# Altium project S7CAS-PLEIADES-CARTES-MERE_P07.PrjPcb (part 4 of 4)

## Sheet S7CAS-PLEIADES-CARTE-MERE_P07_ADC.SchDoc
size Tabloid; DocumentNumber: 15; SheetNumber: 15; SheetTotal: 16; Sheet_Name: ADC; Size: 11x17
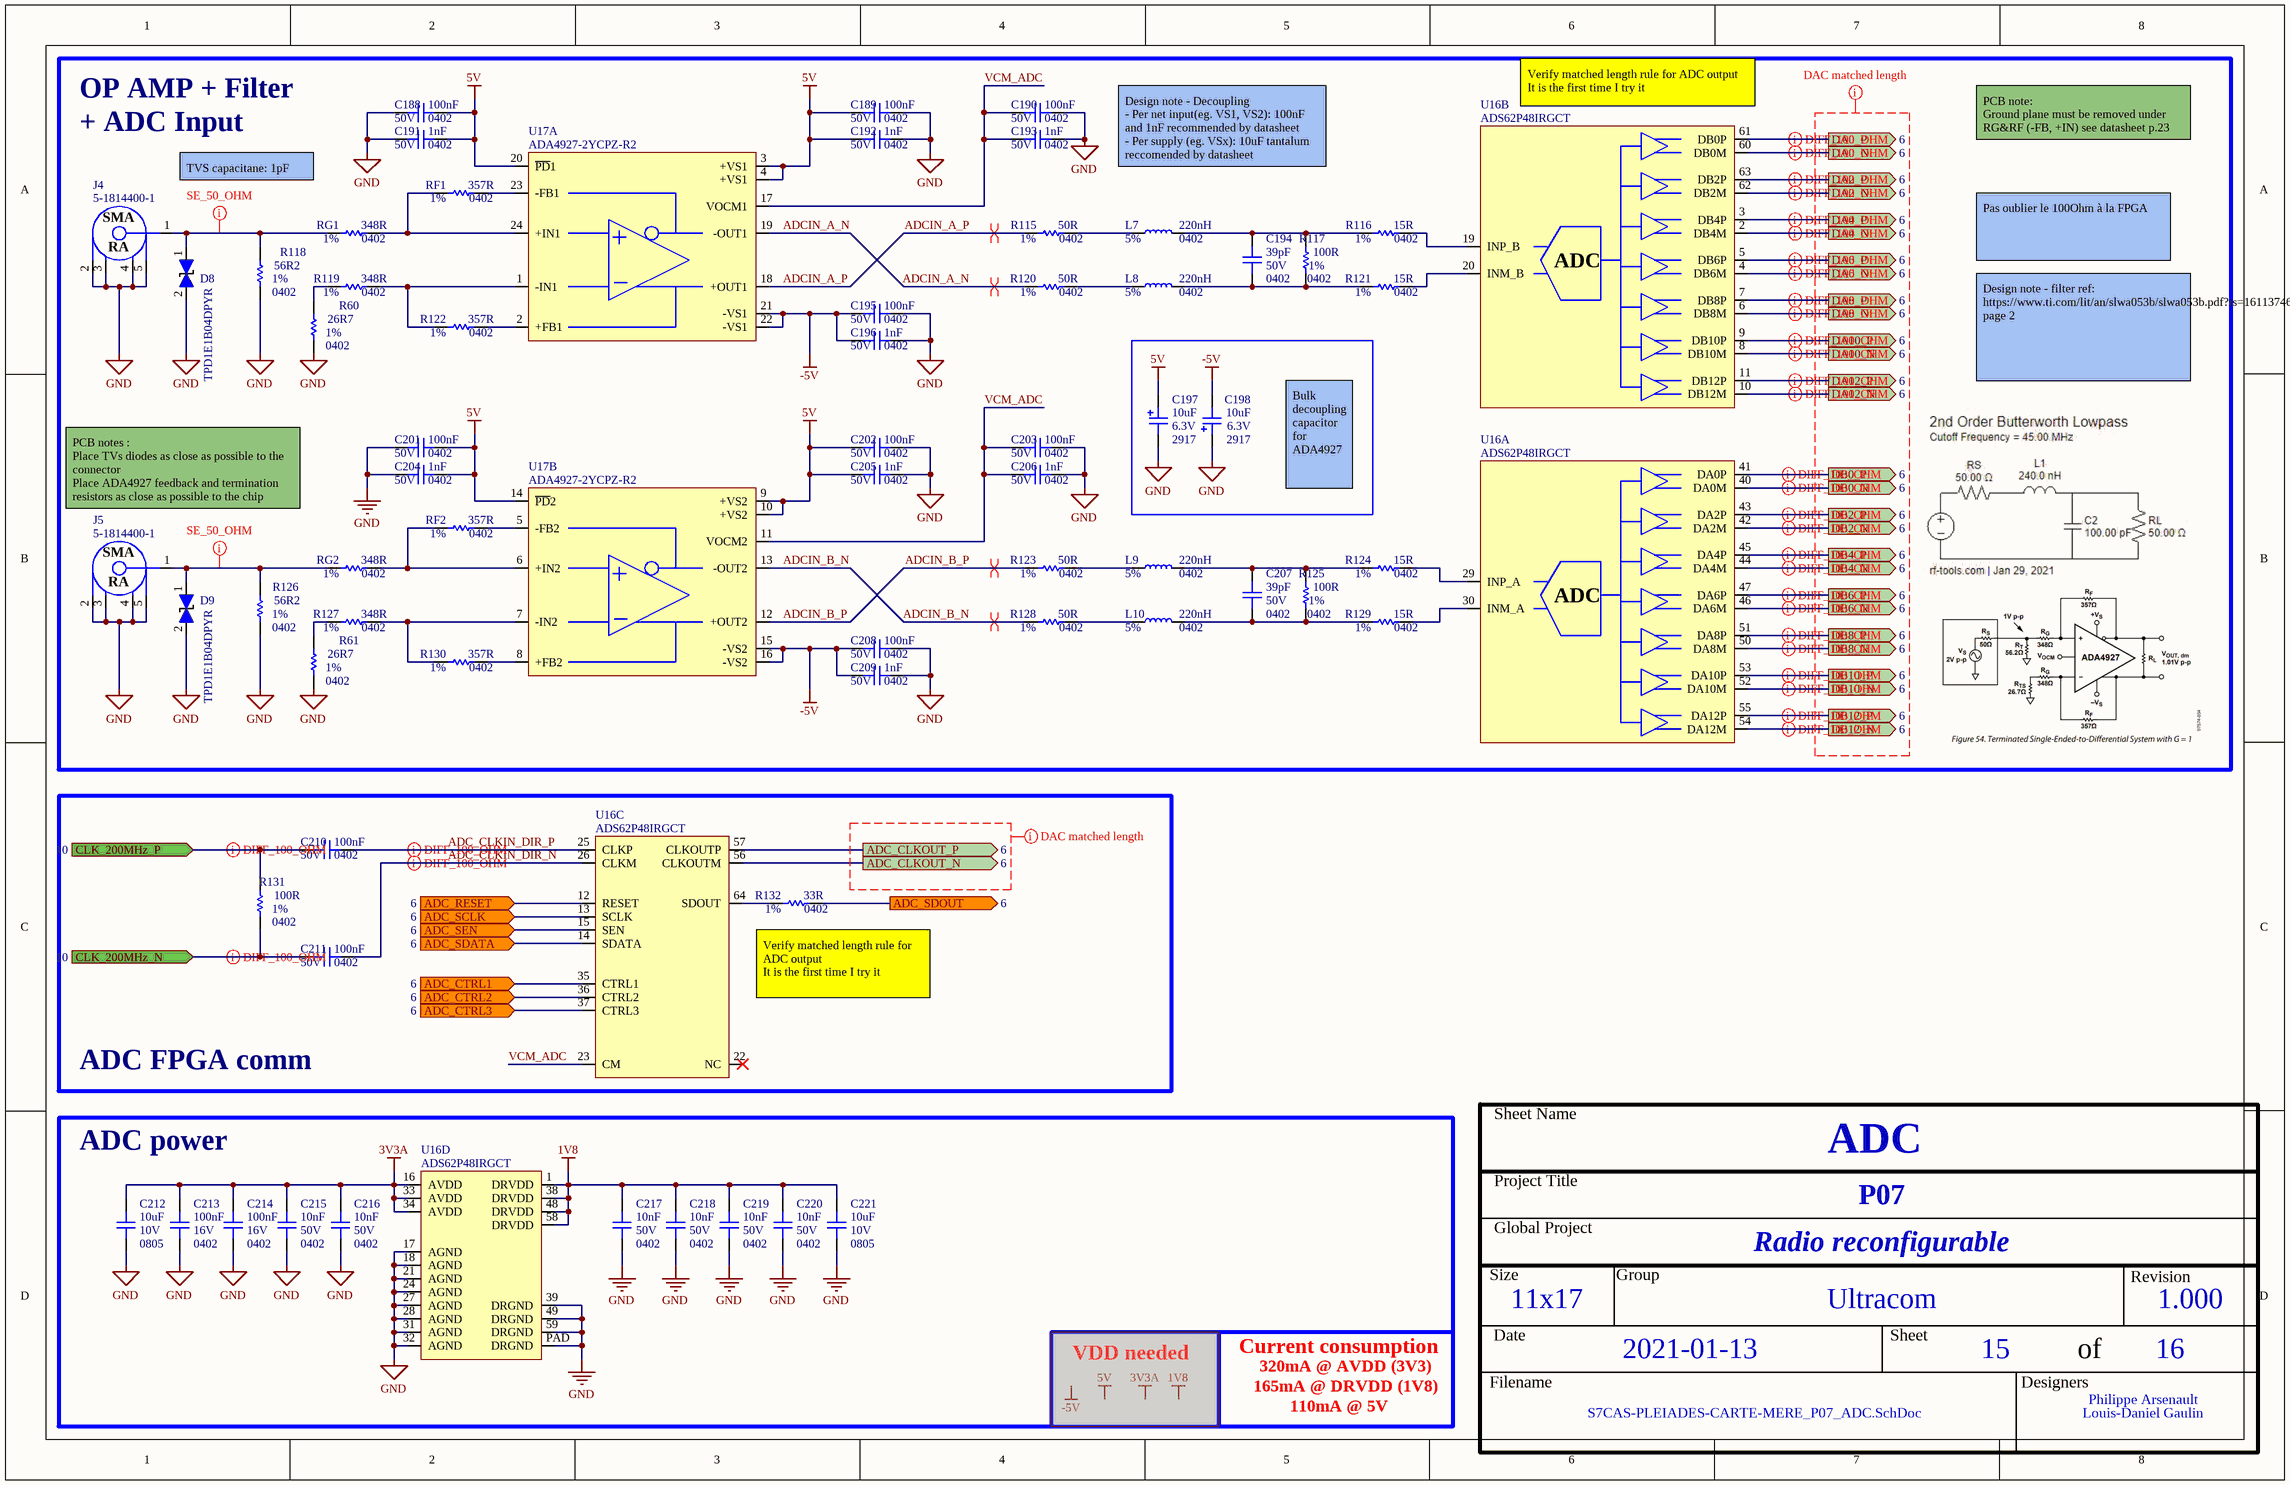
[diagram p14: S7CAS-PLEIADES-CARTE-MERE_P07_ADC.SchDoc]

### Parts
C188  value 100nF  Voltage: 50V  Package: 0402  [CAP_0402]  (hidden comment: CAP - 0402)
C189  value 100nF  Voltage: 50V  Package: 0402  [CAP_0402]  (hidden comment: CAP - 0402)
C190  value 100nF  Voltage: 50V  Package: 0402  [CAP_0402]  (hidden comment: CAP - 0402)
C191  value 1nF  Voltage: 50V  Package: 0402  [CAP_0402]  (hidden comment: CAP - 0402)
C192  value 1nF  Voltage: 50V  Package: 0402  [CAP_0402]  (hidden comment: CAP - 0402)
C193  value 1nF  Voltage: 50V  Package: 0402  [CAP_0402]  (hidden comment: CAP - 0402)
C194  value 39pF  Voltage: 50V  Package: 0402  [CAP_0402]  (hidden comment: CAP - 0402)
C195  value 100nF  Voltage: 50V  Package: 0402  [CAP_0402]  (hidden comment: CAP - 0402)
C196  value 1nF  Voltage: 50V  Package: 0402  [CAP_0402]  (hidden comment: CAP - 0402)
C197  value 10uF  Voltage: 6.3V  Package: 2917  [CAP_TAN_2917(D)]  (hidden comment: CAP - TANTALUM - CASE D)
C198  value 10uF  Voltage: 6.3V  Package: 2917  [CAP_TAN_2917(D)]  (hidden comment: CAP - TANTALUM - CASE D)
C201  value 100nF  Voltage: 50V  Package: 0402  [CAP_0402]  (hidden comment: CAP - 0402)
C202  value 100nF  Voltage: 50V  Package: 0402  [CAP_0402]  (hidden comment: CAP - 0402)
C203  value 100nF  Voltage: 50V  Package: 0402  [CAP_0402]  (hidden comment: CAP - 0402)
C204  value 1nF  Voltage: 50V  Package: 0402  [CAP_0402]  (hidden comment: CAP - 0402)
C205  value 1nF  Voltage: 50V  Package: 0402  [CAP_0402]  (hidden comment: CAP - 0402)
C206  value 1nF  Voltage: 50V  Package: 0402  [CAP_0402]  (hidden comment: CAP - 0402)
C207  value 39pF  Voltage: 50V  Package: 0402  [CAP_0402]  (hidden comment: CAP - 0402)
C208  value 100nF  Voltage: 50V  Package: 0402  [CAP_0402]  (hidden comment: CAP - 0402)
C209  value 1nF  Voltage: 50V  Package: 0402  [CAP_0402]  (hidden comment: CAP - 0402)
C210  value 100nF  Voltage: 50V  Package: 0402  [CAP_0402]  (hidden comment: CAP - 0402)
C211  value 100nF  Voltage: 50V  Package: 0402  [CAP_0402]  (hidden comment: CAP - 0402)
C212  value 10uF  Voltage: 10V  Package: 0805  [CAP_0805]  (hidden comment: CAP - 0805)
C213  value 100nF  Voltage: 16V  Package: 0402  [CAP_0402]  (hidden comment: CAP - 0402)
C214  value 100nF  Voltage: 16V  Package: 0402  [CAP_0402]  (hidden comment: CAP - 0402)
C215  value 10nF  Voltage: 50V  Package: 0402  [CAP_0402]  (hidden comment: CAP - 0402)
C216  value 10nF  Voltage: 50V  Package: 0402  [CAP_0402]  (hidden comment: CAP - 0402)
C217  value 10nF  Voltage: 50V  Package: 0402  [CAP_0402]  (hidden comment: CAP - 0402)
C218  value 10nF  Voltage: 50V  Package: 0402  [CAP_0402]  (hidden comment: CAP - 0402)
C219  value 10nF  Voltage: 50V  Package: 0402  [CAP_0402]  (hidden comment: CAP - 0402)
C220  value 10nF  Voltage: 50V  Package: 0402  [CAP_0402]  (hidden comment: CAP - 0402)
C221  value 10uF  Voltage: 10V  Package: 0805  [CAP_0805]  (hidden comment: CAP - 0805)
D8  TPD1E1B04DPYR  [TVS_DATA_TPD1E1B04DPYR]
D9  TPD1E1B04DPYR  [TVS_DATA_TPD1E1B04DPYR]
J4  5-1814400-1  [CONN_SMA_5-1814400-1]
J5  5-1814400-1  [CONN_SMA_5-1814400-1]
L7  value 220nH  Precision: 5%  Package: 0402  [IND_0402]  (hidden comment: IND_0402)
L8  value 220nH  Precision: 5%  Package: 0402  [IND_0402]  (hidden comment: IND_0402)
L9  value 220nH  Precision: 5%  Package: 0402  [IND_0402]  (hidden comment: IND_0402)
L10  value 220nH  Precision: 5%  Package: 0402  [IND_0402]  (hidden comment: IND_0402)
R60  value 26R7  Package: 0402  Precision: 1%  [RES_0402]  (hidden comment: RES - 0402)
R61  value 26R7  Package: 0402  Precision: 1%  [RES_0402]  (hidden comment: RES - 0402)
R115  value 50R  Package: 0402  Precision: 1%  [RES_0402]  (hidden comment: RES - 0402)
R116  value 15R  Package: 0402  Precision: 1%  [RES_0402]  (hidden comment: RES - 0402)
R117  value 100R  Package: 0402  Precision: 1%  [RES_0402]  (hidden comment: RES - 0402)
R118  value 56R2  Package: 0402  Precision: 1%  [RES_0402]  (hidden comment: RES - 0402)
R119  value 348R  Package: 0402  Precision: 1%  [RES_0402]  (hidden comment: RES - 0402)
R120  value 50R  Package: 0402  Precision: 1%  [RES_0402]  (hidden comment: RES - 0402)
R121  value 15R  Package: 0402  Precision: 1%  [RES_0402]  (hidden comment: RES - 0402)
R122  value 357R  Package: 0402  Precision: 1%  [RES_0402]  (hidden comment: RES - 0402)
R123  value 50R  Package: 0402  Precision: 1%  [RES_0402]  (hidden comment: RES - 0402)
R124  value 15R  Package: 0402  Precision: 1%  [RES_0402]  (hidden comment: RES - 0402)
R125  value 100R  Package: 0402  Precision: 1%  [RES_0402]  (hidden comment: RES - 0402)
R126  value 56R2  Package: 0402  Precision: 1%  [RES_0402]  (hidden comment: RES - 0402)
R127  value 348R  Package: 0402  Precision: 1%  [RES_0402]  (hidden comment: RES - 0402)
R128  value 50R  Package: 0402  Precision: 1%  [RES_0402]  (hidden comment: RES - 0402)
R129  value 15R  Package: 0402  Precision: 1%  [RES_0402]  (hidden comment: RES - 0402)
R130  value 357R  Package: 0402  Precision: 1%  [RES_0402]  (hidden comment: RES - 0402)
R131  value 100R  Package: 0402  Precision: 1%  [RES_0402]  (hidden comment: RES - 0402)
R132  value 33R  Package: 0402  Precision: 1%  [RES_0402]  (hidden comment: RES - 0402)
RF1  value 357R  Package: 0402  Precision: 1%  [RES_0402]  (hidden comment: RES - 0402)
RF2  value 357R  Package: 0402  Precision: 1%  [RES_0402]  (hidden comment: RES - 0402)
RG1  value 348R  Package: 0402  Precision: 1%  [RES_0402]  (hidden comment: RES - 0402)
RG2  value 348R  Package: 0402  Precision: 1%  [RES_0402]  (hidden comment: RES - 0402)
U16  ADS62P48IRGCT  [ADC_ADS62P48IRGCT]  (parts A,B,C,D of 4)
U17  ADA4927-2YCPZ-R2  [OPAMP_ADA4927-2YCPZ-R2]  (parts A,B of 2)

### Blocks framed on the sheet
ADC FPGA comm: C210 C211 R131 R132 U16
ADC power: C212-C221 U16

### Ports
ADC_CLKOUT_N (out, see 6), ADC_CLKOUT_P (out, see 6), ADC_CTRL1 (in, see 6), ADC_CTRL2 (in, see 6), ADC_CTRL3 (in, see 6), ADC_RESET (in, see 6), ADC_SCLK (in, see 6), ADC_SDATA (in, see 6), ADC_SDOUT (out, see 6), ADC_SEN (in, see 6), CLK_200MHz_N (in, see 10), CLK_200MHz_P (in, see 10), DA0_N (out, see 6), DA0_P (out, see 6), DA2_N (out, see 6), DA2_P (out, see 6), DA4_N (out, see 6), DA4_P (out, see 6), DA6_N (out, see 6), DA6_P (out, see 6), DA8_N (out, see 6), DA8_P (out, see 6), DA10_N (out, see 6), DA10_P (out, see 6), DA12_N (out, see 6), DA12_P (out, see 6), DB0_N (out, see 6), DB0_P (out, see 6), DB2_N (out, see 6), DB2_P (out, see 6), DB4_N (out, see 6), DB4_P (out, see 6), DB6_N (out, see 6), DB6_P (out, see 6), DB8_N (out, see 6), DB8_P (out, see 6), DB10_N (out, see 6), DB10_P (out, see 6), DB12_N (out, see 6), DB12_P (out, see 6)

### Nets
1V8: C217.2 C218.2 C219.2 C220.2 C221.2 U16.1(DRVDD) U16.38(DRVDD) U16.48(DRVDD) U16.58(DRVDD)
3V3A: C212.2 C213.2 C214.2 C215.2 C216.2 U16.16(AVDD) U16.33(AVDD) U16.34(AVDD)
5V: C188.1 C189.2 C191.1 C192.2 C197.1 C201.1 C202.2 C204.1 C205.2 U17.3(+VS1) U17.4(+VS1) U17.9(+VS2) U17.10(+VS2) U17.14(~{PD}2) U17.20(~{PD}1)
-5V: C195.2 C196.2 C198.2 C208.2 C209.2 U17.15(-VS2) U17.16(-VS2) U17.21(-VS1) U17.22(-VS1)
GND: C188.2 C189.1 C190.1 C191.2 C192.1 C193.1 C195.1 C196.1 C197.2 C198.1 C201.2 C202.1 C203.1 C204.2 C205.1 C206.1 C208.1 C209.1 C212.1 C213.1 C214.1 C215.1 C216.1 C217.1 C218.1 C219.1 C220.1 C221.1 D8.2(i/o) D9.2(i/o) J4.2 J4.3 J4.4 J4.5 J5.2 J5.3 J5.4 J5.5 R60.1 R61.1 R118.1 R126.1 U16.17(AGND) U16.18(AGND) U16.21(AGND) U16.24(AGND) U16.27(AGND) U16.28(AGND) U16.31(AGND) U16.32(AGND) U16.39(DRGND) U16.49(DRGND) U16.59(DRGND) U16.PAD(DRGND)
ADC_CLKIN_DIR_N: C211.1 U16.26(CLKM)
ADC_CLKIN_DIR_P: C210.1 U16.25(CLKP)
ADC_CLKOUT_N: U16.56(CLKOUTM) ; port ADC_CLKOUT_N
ADC_CLKOUT_P: U16.57(CLKOUTP) ; port ADC_CLKOUT_P
ADC_CTRL1: U16.35(CTRL1) ; port ADC_CTRL1
ADC_CTRL2: U16.36(CTRL2) ; port ADC_CTRL2
ADC_CTRL3: U16.37(CTRL3) ; port ADC_CTRL3
ADC_RESET: U16.12(RESET) ; port ADC_RESET
ADC_SCLK: U16.13(SCLK) ; port ADC_SCLK
ADC_SDATA: U16.14(SDATA) ; port ADC_SDATA
ADC_SDOUT: R132.1 ; port ADC_SDOUT
ADC_SEN: U16.15(SEN) ; port ADC_SEN
ADCIN_A_N: R120.2 U17.19(-OUT1)
ADCIN_A_P: R115.2 U17.18(+OUT1)
ADCIN_B_N: R128.2 U17.13(-OUT2)
ADCIN_B_P: R123.2 U17.12(+OUT2)
CLK_200MHz_N: C211.2 R131.1 ; port CLK_200MHz_N
CLK_200MHz_P: C210.2 R131.2 ; port CLK_200MHz_P
DA0_N: U16.60(DB0M) ; port DA0_N
DA0_P: U16.61(DB0P) ; port DA0_P
DA2_N: U16.62(DB2M) ; port DA2_N
DA2_P: U16.63(DB2P) ; port DA2_P
DA4_N: U16.2(DB4M) ; port DA4_N
DA4_P: U16.3(DB4P) ; port DA4_P
DA6_N: U16.4(DB6M) ; port DA6_N
DA6_P: U16.5(DB6P) ; port DA6_P
DA8_N: U16.6(DB8M) ; port DA8_N
DA8_P: U16.7(DB8P) ; port DA8_P
DA10_N: U16.8(DB10M) ; port DA10_N
DA10_P: U16.9(DB10P) ; port DA10_P
DA12_N: U16.10(DB12M) ; port DA12_N
DA12_P: U16.11(DB12P) ; port DA12_P
DB0_N: U16.40(DA0M) ; port DB0_N
DB0_P: U16.41(DA0P) ; port DB0_P
DB2_N: U16.42(DA2M) ; port DB2_N
DB2_P: U16.43(DA2P) ; port DB2_P
DB4_N: U16.44(DA4M) ; port DB4_N
DB4_P: U16.45(DA4P) ; port DB4_P
DB6_N: U16.46(DA6M) ; port DB6_N
DB6_P: U16.47(DA6P) ; port DB6_P
DB8_N: U16.50(DA8M) ; port DB8_N
DB8_P: U16.51(DA8P) ; port DB8_P
DB10_N: U16.52(DA10M) ; port DB10_N
DB10_P: U16.53(DA10P) ; port DB10_P
DB12_N: U16.54(DA12M) ; port DB12_N
DB12_P: U16.55(DA12P) ; port DB12_P
VCM_ADC: C190.2 C193.2 C203.2 C206.2 U16.23(CM) U17.11(VOCM2) U17.17(VOCM1)
NetC194_1: C194.1 L8.1 R117.1 R121.2
NetC194_2: C194.2 L7.1 R116.2 R117.2
NetC207_1: C207.1 L10.1 R125.1 R129.2
NetC207_2: C207.2 L9.1 R124.2 R125.2
NetD8_1: D8.1(i/o) J4.1 R118.2 RG1.2
NetD9_1: D9.1(i/o) J5.1 R126.2 RG2.2
NetL7_2: L7.2 R115.1
NetL8_2: L8.2 R120.1
NetL9_2: L9.2 R123.1
NetL10_2: L10.2 R128.1
NetR60_2: R60.2 R119.2
NetR61_2: R61.2 R127.2
NetR116_1: R116.1 U16.19(INP_B)
NetR119_1: R119.1 R122.2 U17.1(-IN1)
NetR121_1: R121.1 U16.20(INM_B)
NetR122_1: R122.1 U17.2(+FB1)
NetR124_1: R124.1 U16.29(INP_A)
NetR127_1: R127.1 R130.2 U17.7(-IN2)
NetR129_1: R129.1 U16.30(INM_A)
NetR130_1: R130.1 U17.8(+FB2)
NetR132_2: R132.2 U16.64(SDOUT)
NetRF1_1: RF1.1 U17.23(-FB1)
NetRF1_2: RF1.2 RG1.1 U17.24(+IN1)
NetRF2_1: RF2.1 U17.5(-FB2)
NetRF2_2: RF2.2 RG2.1 U17.6(+IN2)

Not connected (* = marked no-connect by the designer): U16 22(NC)*

### Layout directives
differential pair; net class DIFF_100_OHM: ADC_CLKIN_DIR_N, ADC_CLKIN_DIR_P, CLK_200MHz_N, CLK_200MHz_P
differential pair; differential pair class DIFF_100_OHM: DA0_N, DA0_P, DA2_N, DA2_P, DA4_N, DA4_P, DA6_N, DA6_P, DA8_N, DA8_P, DA10_N, DA10_P, DA12_N, DA12_P, DB0_N, DB0_P, DB2_N, DB2_P, DB4_N, DB4_P, DB6_N, DB6_P, DB8_N, DB8_P, DB10_N, DB10_P, DB12_N, DB12_P
rule Matched Net Lengths [Tolerance = 1mil]; net class DAC_OUT: (no net found under the mark)
mark named SE_50_OHM: NetD8_1, NetD9_1
differential pair: ADCIN_A_N, ADCIN_A_P, ADCIN_B_N, ADCIN_B_P

### Notes on the sheet
- OP AMP + Filter
- + ADC Input
- Design note - Decoupling
  - Per net input(eg. VS1, VS2): 100nF and 1nF recommended by datasheet
  - Per supply (eg. VSx): 10uF tantalum reccomended by datasheet
- (near U16) Verify matched length rule for ADC output
  It is the first time I try it
- PCB note:
  Ground plane must be removed under RG&RF (-FB, +IN) see datasheet p.23
- TVS capacitane: 1pF nom.
- Pas oublier le 100Ohm à la FPGA
- Design note - filter ref:
  https://www.ti.com/lit/an/slwa053b/slwa053b.pdf?ts=1611374664037&ref_url=https%253A%252F%252Fwww.google.com%252F
  page 2
- Bulk decoupling capacitor for ADA4927
- PCB notes :
  Place TVs diodes as close as possible to the connector
  Place ADA4927 feedback and termination resistors as close as possible to the chip
- Verify matched length rule for ADC output
  It is the first time I try it
- VDD needed
- Current consumption
- 320mA @ AVDD (3V3)
- 110mA @ 5V
- 165mA @ DRVDD (1V8)
- Sheet Name
- Project Title
- Global Project
- Size
- Group
- Revision
- Date
- Sheet
- of
- Filename
- Designers
- (in symbol ADC_ADS62P48IRGCT, part A) ADC
- (in symbol ADC_ADS62P48IRGCT, part B) ADC
- (in symbol CONN_SMA_5-1814400-1) SMA; RA

### Library data of the parts
C188-C196 C201-C211 = CAP - 0402: Precision: 10%; Current: *; CreatedBy: Jonathan Bouchard; Power: *
C197 C198 = CAP_TANT_2917(D): CAP - TANTALUM - 2917; Precision: 10%; Current: *; CreatedBy: Jonathan Bouchard; Power: *
C212 C221 = CAP - 0805: Mfg: CL21B106KPQNNNE; Precision: 10%; Current: *; CreatedBy: Jonathan Bouchard; Power: *
C213 C214 = CAP - 0402: Mfg Part Number: CL05B104KO5NNNC; Precision: 10%; Current: *; CreatedBy: Jonathan Bouchard; Power: *
C215-C220 = CAP - 0402: Mfg Part Number: CL05B103KB5NNNC; Precision: 10%; Current: *; CreatedBy: Jonathan Bouchard; Temperature: X7R; Power: *
D8 D9 = TVS_DATA_TPD1E1B04DPYR: TVS - TVS DIODE 3.6V 8.5V - 0402; Manufacturer #1: Texas Instruments; Current Rating: 6.3Apeak; Power Max: 50Wpeak; GRAMS Lib Spec: 2.8; Magnetic Material: Unknown; Polarized: No; Value: *; Tolerance: *; Voltage Rating: 3.6V; HelpURL: http://www.ti.com/lit/ds/symlink/tpd1e1b04.pdf; CreatedBy/Date: Keven Deslandes - 2018/10/19; VerifiedBy: Caroline Paulin - 28 janv 2019; Temperature: -40°C ~ 125°C (TA); Package: 0402; Manufacturer #2: *; Note: *; Assembly Type: SMD; Part Number #2: *; Part Number #1: TPD1E1B04DPYR; Supplier 1: Digi-Key; Supplier Part Number 1: 296-47364-1-ND; Cryo: UNKNOWN
J4 J5 = CONN_SMA_5-1814400-1: CONN -  SMA JACK R/A 50 OHM - TH; Mfg: TE Connectivity AMP Connectors; Voltage: *; Current: *; Power: *; Mfg Part Number: 5-1814400-1; HelpURL: http://www.te.com/commerce/DocumentDelivery/DDEController?Action=srchrtrv&DocNm=1814400&DocType=Customer+Drawing&DocLang=English; CreatedBy: Jonathan Bouchard; Temperature: -55°C ~ 85°C; Value: *; Precision: *; Package: TH-5; Supplier 1: Digikey; Supplier Part Number 1: A97593-ND
R60 R61 R115-R132 RF1 RF2 RG1 RG2 = RES - 0402: Voltage: 50V; Power: 1/16W; Current: *; CreatedBy: Jonathan Bouchard
U16 = ADC_ADS62P48IRGCT: ADC - 14 BIT 210MSPS SUAL - VQFN-64; Voltage: 3.15 V ~ 3.6 V / 1.7 V ~ 1.9 V; Mfg: Texas Instruments; Precision: 14 Bit; Current: *; Power: *; Mfg Part Number: ADS62P48IRGCT; HelpURL: http://www.ti.com/lit/ds/symlink/ads62p48.pdf; CreatedBy: Jonathan Bouchard; Temperature: -40°C ~ 85°C; Value: *; Package: VQFN-64; Supplier 1: Digikey; Supplier Part Number 1: 296-24611-1-ND
U17 = OPAMP_ADA4927-2YCPZ-R2: OPAMP - CFA 2.3GHZ - QFN-24; Voltage: 4.5 V ~ 11 V, ±2.25 V ~ 5.5 V; Current: 65mA; Mfg: Analog Devices; Power: *; Mfg Part Number: ADA4927-2YCPZ-R2; HelpURL: http://www.analog.com/media/en/technical-documentation/data-sheets/ADA4927-1_4927-2.pdf; CreatedBy: Jonathan Bouchard; Temperature: -40°C ~ 105°C; Value: *; Precision: *; Package: QFN-24; Supplier 1: Digikey; Supplier Part Number 1: ADA4927-2YCPZ-R2CT-ND
L7-L10 = IND_0402: Voltage: *; CreatedBy: Jonathan Bouchard; Power: *; NI: *; Current: *

## Sheet S7CAS-PLEIADES-CARTE-MERE_P07_DAC.SchDoc
size Tabloid; DocumentNumber: 16; SheetNumber: 16; SheetTotal: 16; Sheet_Name: DAC; Size: 11x17
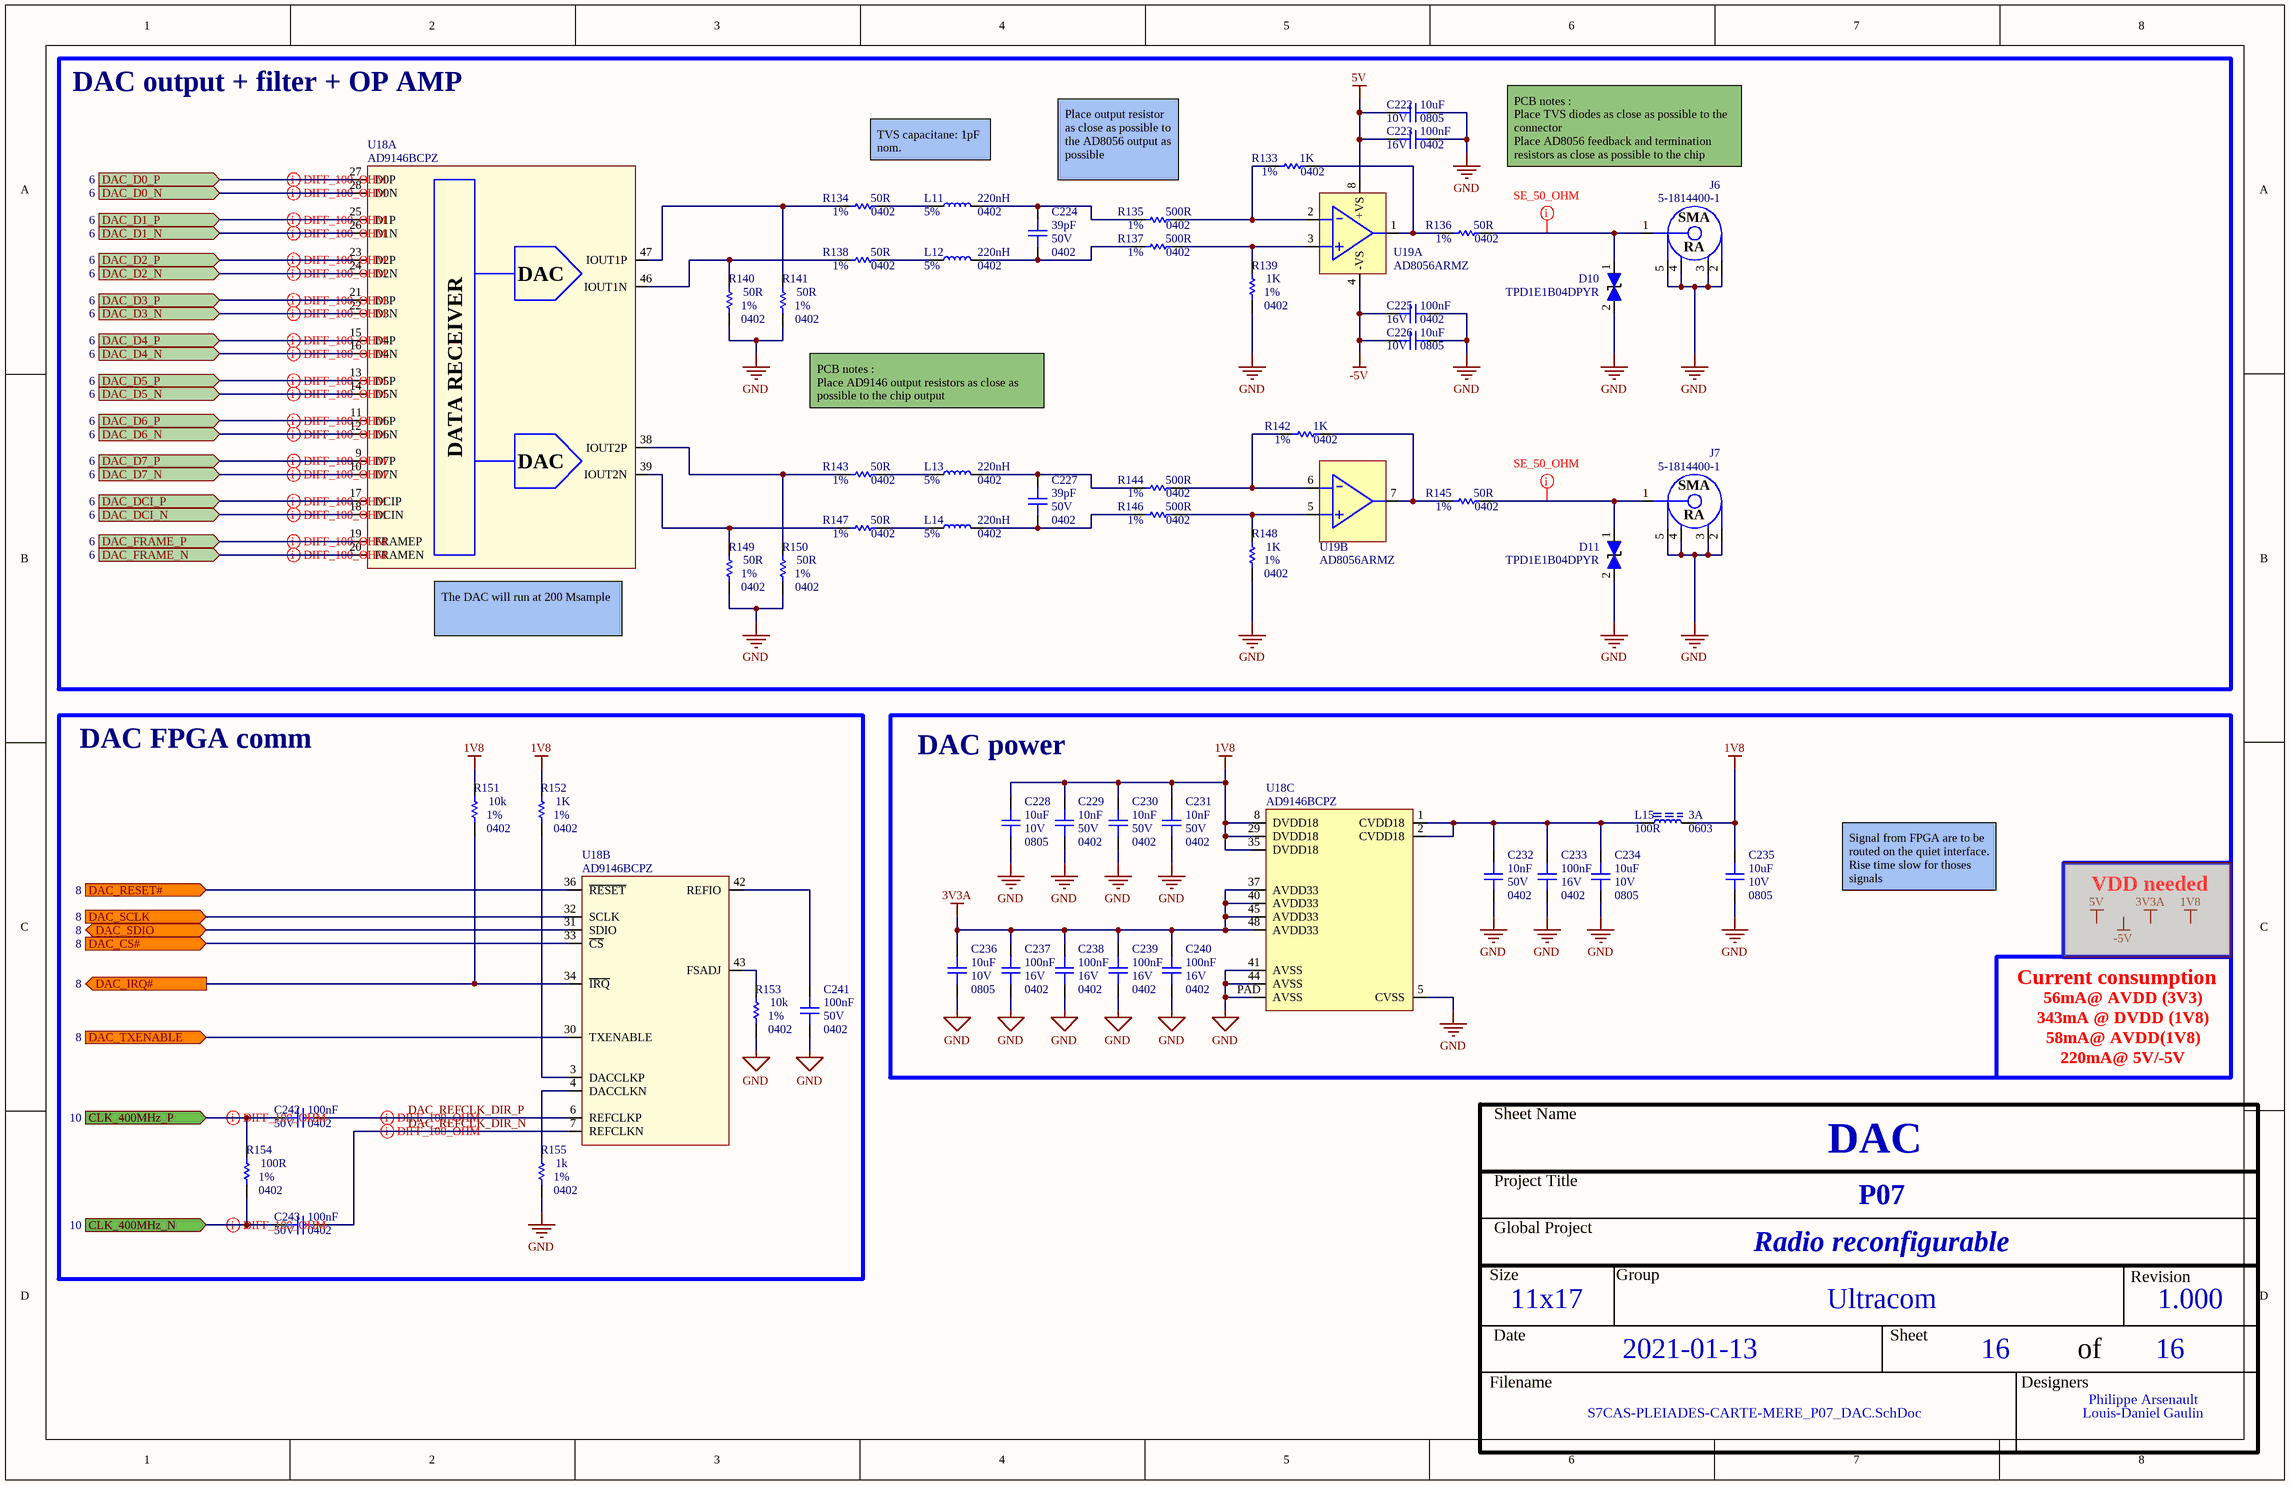
[diagram p15: S7CAS-PLEIADES-CARTE-MERE_P07_DAC.SchDoc]

### Parts
C222  value 10uF  Voltage: 10V  Package: 0805  [CAP_0805]  (hidden comment: CAP - 0805)
C223  value 100nF  Voltage: 16V  Package: 0402  [CAP_0402]  (hidden comment: CAP - 0402)
C224  value 39pF  Voltage: 50V  Package: 0402  [CAP_0402]  (hidden comment: CAP - 0402)
C225  value 100nF  Voltage: 16V  Package: 0402  [CAP_0402]  (hidden comment: CAP - 0402)
C226  value 10uF  Voltage: 10V  Package: 0805  [CAP_0805]  (hidden comment: CAP - 0805)
C227  value 39pF  Voltage: 50V  Package: 0402  [CAP_0402]  (hidden comment: CAP - 0402)
C228  value 10uF  Voltage: 10V  Package: 0805  [CAP_0805]  (hidden comment: CAP - 0805)
C229  value 10nF  Voltage: 50V  Package: 0402  [CAP_0402]  (hidden comment: CAP - 0402)
C230  value 10nF  Voltage: 50V  Package: 0402  [CAP_0402]  (hidden comment: CAP - 0402)
C231  value 10nF  Voltage: 50V  Package: 0402  [CAP_0402]  (hidden comment: CAP - 0402)
C232  value 10nF  Voltage: 50V  Package: 0402  [CAP_0402]  (hidden comment: CAP - 0402)
C233  value 100nF  Voltage: 16V  Package: 0402  [CAP_0402]  (hidden comment: CAP - 0402)
C234  value 10uF  Voltage: 10V  Package: 0805  [CAP_0805]  (hidden comment: CAP - 0805)
C235  value 10uF  Voltage: 10V  Package: 0805  [CAP_0805]  (hidden comment: CAP - 0805)
C236  value 10uF  Voltage: 10V  Package: 0805  [CAP_0805]  (hidden comment: CAP - 0805)
C237  value 100nF  Voltage: 16V  Package: 0402  [CAP_0402]  (hidden comment: CAP - 0402)
C238  value 100nF  Voltage: 16V  Package: 0402  [CAP_0402]  (hidden comment: CAP - 0402)
C239  value 100nF  Voltage: 16V  Package: 0402  [CAP_0402]  (hidden comment: CAP - 0402)
C240  value 100nF  Voltage: 16V  Package: 0402  [CAP_0402]  (hidden comment: CAP - 0402)
C241  value 100nF  Voltage: 50V  Package: 0402  [CAP_0402]  (hidden comment: CAP - 0402)
C242  value 100nF  Voltage: 50V  Package: 0402  [CAP_0402]  (hidden comment: CAP - 0402)
C243  value 100nF  Voltage: 50V  Package: 0402  [CAP_0402]  (hidden comment: CAP - 0402)
D10  TPD1E1B04DPYR  [TVS_DATA_TPD1E1B04DPYR]
D11  TPD1E1B04DPYR  [TVS_DATA_TPD1E1B04DPYR]
J6  5-1814400-1  [CONN_SMA_5-1814400-1]
J7  5-1814400-1  [CONN_SMA_5-1814400-1]
L11  value 220nH  Precision: 5%  Package: 0402  [IND_0402]  (hidden comment: IND_0402)
L12  value 220nH  Precision: 5%  Package: 0402  [IND_0402]  (hidden comment: IND_0402)
L13  value 220nH  Precision: 5%  Package: 0402  [IND_0402]  (hidden comment: IND_0402)
L14  value 220nH  Precision: 5%  Package: 0402  [IND_0402]  (hidden comment: IND_0402)
L15  value 100R  Current: 3A  Package: 0603  [FER_0603]  (hidden comment: FER - 0603)
R133  value 1K  Package: 0402  Precision: 1%  [RES_0402]  (hidden comment: RES - 0402)
R134  value 50R  Package: 0402  Precision: 1%  [RES_0402]  (hidden comment: RES - 0402)
R135  value 500R  Package: 0402  Precision: 1%  [RES_0402]  (hidden comment: RES - 0402)
R136  value 50R  Package: 0402  Precision: 1%  [RES_0402]  (hidden comment: RES - 0402)
R137  value 500R  Package: 0402  Precision: 1%  [RES_0402]  (hidden comment: RES - 0402)
R138  value 50R  Package: 0402  Precision: 1%  [RES_0402]  (hidden comment: RES - 0402)
R139  value 1K  Package: 0402  Precision: 1%  [RES_0402]  (hidden comment: RES - 0402)
R140  value 50R  Package: 0402  Precision: 1%  [RES_0402]  (hidden comment: RES - 0402)
R141  value 50R  Package: 0402  Precision: 1%  [RES_0402]  (hidden comment: RES - 0402)
R142  value 1K  Package: 0402  Precision: 1%  [RES_0402]  (hidden comment: RES - 0402)
R143  value 50R  Package: 0402  Precision: 1%  [RES_0402]  (hidden comment: RES - 0402)
R144  value 500R  Package: 0402  Precision: 1%  [RES_0402]  (hidden comment: RES - 0402)
R145  value 50R  Package: 0402  Precision: 1%  [RES_0402]  (hidden comment: RES - 0402)
R146  value 500R  Package: 0402  Precision: 1%  [RES_0402]  (hidden comment: RES - 0402)
R147  value 50R  Package: 0402  Precision: 1%  [RES_0402]  (hidden comment: RES - 0402)
R148  value 1K  Package: 0402  Precision: 1%  [RES_0402]  (hidden comment: RES - 0402)
R149  value 50R  Package: 0402  Precision: 1%  [RES_0402]  (hidden comment: RES - 0402)
R150  value 50R  Package: 0402  Precision: 1%  [RES_0402]  (hidden comment: RES - 0402)
R151  value 10k  Package: 0402  Precision: 1%  [RES_0402]  (hidden comment: RES - 0402)
R152  value 1K  Package: 0402  Precision: 1%  [RES_0402]  (hidden comment: RES - 0402)
R153  value 10k  Package: 0402  Precision: 1%  [RES_0402]  (hidden comment: RES - 0402)
R154  value 100R  Package: 0402  Precision: 1%  [RES_0402]  (hidden comment: RES - 0402)
R155  value 1k  Package: 0402  Precision: 1%  [RES_0402]  (hidden comment: RES - 0402)
U18  AD9146BCPZ  [DAC_AD9146BCPZ]  (parts A,B,C of 3)
U19  AD8056ARMZ  [OPAMP_AD8056ARMZ]  (parts A,B of 2)

### Blocks framed on the sheet
DAC output + filter + OP AMP: C222-C227 D10 D11 J6 J7 L11-L14 R133-R150 U18 U19
DAC FPGA comm: C241-C243 R151-R155 U18
DAC power: C228-C240 L15 U18

### Ports
CLK_400MHz_N (in, see 10), CLK_400MHz_P (in, see 10), DAC_CS# (in, see 8), DAC_D0_N (in, see 6), DAC_D0_P (in, see 6), DAC_D1_N (in, see 6), DAC_D1_P (in, see 6), DAC_D2_N (in, see 6), DAC_D2_P (in, see 6), DAC_D3_N (in, see 6), DAC_D3_P (in, see 6), DAC_D4_N (in, see 6), DAC_D4_P (in, see 6), DAC_D5_N (in, see 6), DAC_D5_P (in, see 6), DAC_D6_N (in, see 6), DAC_D6_P (in, see 6), DAC_D7_N (in, see 6), DAC_D7_P (in, see 6), DAC_DCI_N (in, see 6), DAC_DCI_P (in, see 6), DAC_FRAME_N (in, see 6), DAC_FRAME_P (in, see 6), DAC_IRQ# (out, see 8), DAC_RESET# (in, see 8), DAC_SCLK (in, see 8), DAC_SDIO (bidir, see 8), DAC_TXENABLE (in, see 8)

### Nets
1V8: C228.2 C229.2 C230.2 C231.2 C235.2 L15.1 R151.2 R152.2 U18.8(DVDD18) U18.29(DVDD18) U18.35(DVDD18)
3V3A: C236.2 C237.2 C238.2 C239.2 C240.2 U18.37(AVDD33) U18.40(AVDD33) U18.45(AVDD33) U18.48(AVDD33)
5V: C222.2 C223.2 U19.8(+VS)
-5V: C225.2 C226.2 U19.4(-VS)
GND: C222.1 C223.1 C225.1 C226.1 C228.1 C229.1 C230.1 C231.1 C232.1 C233.1 C234.1 C235.1 C236.1 C237.1 C238.1 C239.1 C240.1 C241.1 D10.2(i/o) D11.2(i/o) J6.2 J6.3 J6.4 J6.5 J7.2 J7.3 J7.4 J7.5 R139.1 R140.1 R141.1 R148.1 R149.1 R150.1 R153.1 R155.1 U18.5(CVSS) U18.41(AVSS) U18.44(AVSS) U18.PAD(AVSS)
CLK_400MHz_N: C243.2 R154.1 ; port CLK_400MHz_N
CLK_400MHz_P: C242.2 R154.2 ; port CLK_400MHz_P
DAC_CS#: U18.33(~{CS}) ; port DAC_CS#
DAC_D0_N: U18.28(D0N) ; port DAC_D0_N
DAC_D0_P: U18.27(D0P) ; port DAC_D0_P
DAC_D1_N: U18.26(D1N) ; port DAC_D1_N
DAC_D1_P: U18.25(D1P) ; port DAC_D1_P
DAC_D2_N: U18.24(D2N) ; port DAC_D2_N
DAC_D2_P: U18.23(D2P) ; port DAC_D2_P
DAC_D3_N: U18.22(D3N) ; port DAC_D3_N
DAC_D3_P: U18.21(D3P) ; port DAC_D3_P
DAC_D4_N: U18.16(D4N) ; port DAC_D4_N
DAC_D4_P: U18.15(D4P) ; port DAC_D4_P
DAC_D5_N: U18.14(D5N) ; port DAC_D5_N
DAC_D5_P: U18.13(D5P) ; port DAC_D5_P
DAC_D6_N: U18.12(D6N) ; port DAC_D6_N
DAC_D6_P: U18.11(D6P) ; port DAC_D6_P
DAC_D7_N: U18.10(D7N) ; port DAC_D7_N
DAC_D7_P: U18.9(D7P) ; port DAC_D7_P
DAC_DCI_N: U18.18(DCIN) ; port DAC_DCI_N
DAC_DCI_P: U18.17(DCIP) ; port DAC_DCI_P
DAC_FRAME_N: U18.20(FRAMEN) ; port DAC_FRAME_N
DAC_FRAME_P: U18.19(FRAMEP) ; port DAC_FRAME_P
DAC_IRQ#: R151.1 U18.34(~{IRQ}) ; port DAC_IRQ#
DAC_REFCLK_DIR_N: C243.1 U18.7(REFCLKN)
DAC_REFCLK_DIR_P: C242.1 U18.6(REFCLKP)
DAC_RESET#: U18.36(~{RESET}) ; port DAC_RESET#
DAC_SCLK: U18.32(SCLK) ; port DAC_SCLK
DAC_SDIO: U18.31(SDIO) ; port DAC_SDIO
DAC_TXENABLE: U18.30(TXENABLE) ; port DAC_TXENABLE
NetC224_1: C224.1 L12.1 R137.2
NetC224_2: C224.2 L11.1 R135.2
NetC227_1: C227.1 L14.1 R146.2
NetC227_2: C227.2 L13.1 R144.2
NetC232_2: C232.2 C233.2 C234.2 L15.2 U18.1(CVDD18) U18.2(CVDD18)
NetC241_2: C241.2 U18.42(REFIO)
NetD10_1: D10.1(i/o) J6.1 R136.1
NetD11_1: D11.1(i/o) J7.1 R145.1
NetL11_2: L11.2 R134.1
NetL12_2: L12.2 R138.1
NetL13_2: L13.2 R143.1
NetL14_2: L14.2 R147.1
NetR133_1: R133.1 R136.2 U19.1(OUT1)
NetR133_2: R133.2 R135.1 U19.2(-IN1)
NetR134_2: R134.2 R141.2 U18.47(IOUT1P)
NetR137_1: R137.1 R139.2 U19.3(+IN1)
NetR138_2: R138.2 R140.2 U18.46(IOUT1N)
NetR142_1: R142.1 R145.2 U19.7(OUT2)
NetR142_2: R142.2 R144.1 U19.6(-IN2)
NetR143_2: R143.2 R150.2 U18.38(IOUT2P)
NetR146_1: R146.1 R148.2 U19.5(+IN2)
NetR147_2: R147.2 R149.2 U18.39(IOUT2N)
NetR152_1: R152.1 U18.3(DACCLKP)
NetR153_2: R153.2 U18.43(FSADJ)
NetR155_2: R155.2 U18.4(DACCLKN)

### Layout directives
differential pair; differential pair class DIFF_100_OHM: DAC_D0_N, DAC_D0_P, DAC_D1_N, DAC_D1_P, DAC_D2_N, DAC_D2_P, DAC_D3_N, DAC_D3_P, DAC_D4_N, DAC_D4_P, DAC_D5_N, DAC_D5_P, DAC_D6_N, DAC_D6_P, DAC_D7_N, DAC_D7_P, DAC_DCI_N, DAC_DCI_P, DAC_FRAME_N, DAC_FRAME_P
mark named SE_50_OHM: NetD10_1, NetD11_1
differential pair; net class DIFF_100_OHM: CLK_400MHz_N, CLK_400MHz_P, DAC_REFCLK_DIR_N, DAC_REFCLK_DIR_P

### Notes on the sheet
- TVS capacitane: 1pF nom.
- PCB notes :
  Place TVS diodes as close as possible to the connector
  Place AD8056 feedback and termination resistors as close as possible to the chip
- Place output resistor as close as possible to the AD8056 output as possible
- PCB notes :
  Place AD9146 output resistors as close as possible to the chip output
- (near U18) The DAC will run at 200 Msample
- Signal from FPGA are to be routed on the quiet interface. Rise time slow for thoses signals
- VDD needed
- Current consumption
- 56mA@ AVDD (3V3)
- 343mA @ DVDD (1V8)
- 58mA@ AVDD(1V8)
- 220mA@ 5V/-5V
- Sheet Name
- Project Title
- Global Project
- Size
- Group
- Revision
- Date
- Sheet
- of
- Filename
- Designers
- (in symbol CONN_SMA_5-1814400-1) SMA; RA
- (in symbol DAC_AD9146BCPZ, part A) DAC; DATA RECEIVER

### Library data of the parts
C222 C226 C228 C234-C236 = CAP - 0805: Mfg: CL21B106KPQNNNE; Precision: 10%; Current: *; CreatedBy: Jonathan Bouchard; Power: *
C223 C225 C233 C237-C240 = CAP - 0402: as C213 on sheet S7CAS-PLEIADES-CARTE-MERE_P07_ADC; Current: *; CreatedBy: Jonathan Bouchard; Power: *
C224 C227 C241-C243 = CAP - 0402: Precision: 10%; Current: *; CreatedBy: Jonathan Bouchard; Power: *
C229-C232 = CAP - 0402: as C215 on sheet S7CAS-PLEIADES-CARTE-MERE_P07_ADC; Current: *; CreatedBy: Jonathan Bouchard; Temperature: X7R; Power: *
D10 D11 = TVS_DATA_TPD1E1B04DPYR: as D8 on sheet S7CAS-PLEIADES-CARTE-MERE_P07_ADC; Value: *; Tolerance: *; Voltage Rating: 3.6V; HelpURL: http://www.ti.com/lit/ds/symlink/tpd1e1b04.pdf; CreatedBy/Date: Keven Deslandes - 2018/10/19; VerifiedBy: Caroline Paulin - 28 janv 2019; Temperature: -40°C ~ 125°C (TA); Package: 0402; Manufacturer #2: *; Note: *; Assembly Type: SMD; Part Number #2: *; Part Number #1: TPD1E1B04DPYR; Supplier 1: Digi-Key; Supplier Part Number 1: 296-47364-1-ND; Cryo: UNKNOWN
J6 J7 = CONN_SMA_5-1814400-1: as J4 on sheet S7CAS-PLEIADES-CARTE-MERE_P07_ADC; Voltage: *; Current: *; Power: *; Mfg Part Number: 5-1814400-1; HelpURL: http://www.te.com/commerce/DocumentDelivery/DDEController?Action=srchrtrv&DocNm=1814400&DocType=Customer+Drawing&DocLang=English; CreatedBy: Jonathan Bouchard; Temperature: -55°C ~ 85°C; Value: *; Precision: *; Package: TH-5; Supplier 1: Digikey; Supplier Part Number 1: A97593-ND
R133-R155 = RES - 0402: Voltage: 50V; Power: 1/16W; Current: *; CreatedBy: Jonathan Bouchard
U18 = DAC_AD9146BCPZ: DAC - 16BIT SRL HIGH SPEED - QFN-48; Voltage: 3.13 V ~ 3.47 V / 1.71 V ~ 1.89 V; Mfg: Analog Devices Inc.; Current: *; Power: *; Mfg Part Number: AD9146BCPZ; HelpURL: http://www.analog.com/media/en/technical-documentation/data-sheets/AD9146.PDF; CreatedBy: Jonathan Bouchard; Temperature: -40°C ~ 85°C; Value: *; Precision: 16 Bit; Package: QFN-48; Supplier 1: Digikey; Supplier Part Number 1: AD9146BCPZ-ND
U19 = OPAMP_AD8056ARMZ: OPAMP - VFB 300MHZ - 8MSOP; Voltage: 8 V ~ 12 V, ±4 V ~ 6 V; Current: 60mA; Mfg: Analog Devices; Power: *; Mfg Part Number: AD8056ARMZ; HelpURL: http://www.analog.com/media/en/technical-documentation/data-sheets/AD8055_8056.pdf; CreatedBy: Jonathan Bouchard; Temperature: -40°C ~ 125°C; Value: *; Precision: *; Package: MSOP-8; Supplier 1: Digikey; Supplier Part Number 1: AD8056ARMZ-REEL7CT-ND
L11-L14 = IND_0402: Voltage: *; CreatedBy: Jonathan Bouchard; Power: *; NI: *; Current: *
L15 = FER - 0603: Voltage: *; CreatedBy: Jonathan Bouchard; Power: *; Precision: *

## Nets that join several sheets
1V2: S7CAS-PLEIADES-CARTE-MERE_P07_LOW_POWER (C7.2 C8.1 U2.4 U2.5), S7CAS-PLEIADES-CARTE-MERE_P07_FPGA_MISC (31 pins)
1V5: S7CAS-PLEIADES-CARTE-MERE_P07_LOW_POWER (9 pins), S7CAS-PLEIADES-CARTE-MERE_P07_FPGA_3 (15 pins), S7CAS-PLEIADES-CARTE-MERE_P07_DDR (26 pins)
1V8: S7CAS-PLEIADES-CARTE-MERE_P07_LOW_POWER (11 pins), S7CAS-PLEIADES-CARTE-MERE_P07_FPGA_4-5 (10 pins), S7CAS-PLEIADES-CARTE-MERE_P07_ADC (9 pins), S7CAS-PLEIADES-CARTE-MERE_P07_DAC (11 pins)
3V3A: S7CAS-PLEIADES-CARTE-MERE_P07_HIGH_POWER (5 pins), S7CAS-PLEIADES-CARTE-MERE_P07_ADC (8 pins), S7CAS-PLEIADES-CARTE-MERE_P07_DAC (9 pins)
3V3D: S7CAS-PLEIADES-CARTE-MERE_P07_HIGH_POWER (5 pins), S7CAS-PLEIADES-CARTE-MERE_P07_LOW_POWER (22 pins), S7CAS-PLEIADES-CARTE-MERE_P07_FPGA_0 (18 pins), S7CAS-PLEIADES-CARTE-MERE_P07_FPGA_1 (14 pins), S7CAS-PLEIADES-CARTE-MERE_P07_FPGA_2 (39 pins), S7CAS-PLEIADES-CARTE-MERE_P07_FPGA_4-5 (10 pins), S7CAS-PLEIADES-CARTE-MERE_P07_FPGA_MISC (30 pins), S7CAS-PLEIADES-CARTE-MERE_P07_CLOCK (14 pins), S7CAS-PLEIADES-CARTE-MERE_P07_USB (17 pins), S7CAS-PLEIADES-CARTE-MERE_P07_MOT (6 pins), S7CAS-PLEIADES-CARTE-MERE_P07_ETH (12 pins)
5V: S7CAS-PLEIADES-CARTE-MERE_P07_HIGH_POWER (5 pins), S7CAS-PLEIADES-CARTE-MERE_P07_ADC (15 pins), S7CAS-PLEIADES-CARTE-MERE_P07_DAC (C222.2 C223.2 U19.8)
24V: S7CAS-PLEIADES-CARTE-MERE_P07_HIGH_POWER (8 pins), S7CAS-PLEIADES-CARTE-MERE_P07_MOT (6 pins)
-5V: S7CAS-PLEIADES-CARTE-MERE_P07_HIGH_POWER (7 pins), S7CAS-PLEIADES-CARTE-MERE_P07_ADC (9 pins), S7CAS-PLEIADES-CARTE-MERE_P07_DAC (C225.2 C226.2 U19.4)
GND: S7CAS-PLEIADES-CARTE-MERE_P07_TITLE (HS1.1 HS1.2), S7CAS-PLEIADES-CARTE-MERE_P07_HIGH_POWER (73 pins), S7CAS-PLEIADES-CARTE-MERE_P07_LOW_POWER (50 pins), S7CAS-PLEIADES-CARTE-MERE_P07_FPGA_0 (6 pins), S7CAS-PLEIADES-CARTE-MERE_P07_FPGA_1 (5 pins), S7CAS-PLEIADES-CARTE-MERE_P07_FPGA_2 (21 pins), S7CAS-PLEIADES-CARTE-MERE_P07_FPGA_3 (5 pins), S7CAS-PLEIADES-CARTE-MERE_P07_FPGA_4-5 (8 pins), S7CAS-PLEIADES-CARTE-MERE_P07_FPGA_MISC (89 pins), S7CAS-PLEIADES-CARTE-MERE_P07_CLOCK (46 pins), S7CAS-PLEIADES-CARTE-MERE_P07_DDR (60 pins), S7CAS-PLEIADES-CARTE-MERE_P07_USB (16 pins), S7CAS-PLEIADES-CARTE-MERE_P07_MOT (22 pins), S7CAS-PLEIADES-CARTE-MERE_P07_ETH (25 pins), S7CAS-PLEIADES-CARTE-MERE_P07_ADC (54 pins), S7CAS-PLEIADES-CARTE-MERE_P07_DAC (40 pins)
VTT: S7CAS-PLEIADES-CARTE-MERE_P07_LOW_POWER (5 pins), S7CAS-PLEIADES-CARTE-MERE_P07_DDR (53 pins)
VTT_REF: S7CAS-PLEIADES-CARTE-MERE_P07_LOW_POWER (C25.2 U6.6), S7CAS-PLEIADES-CARTE-MERE_P07_DDR (C138.1 C139.1 U12.H1 U12.M8)
ADC_CLKOUT_N: S7CAS-PLEIADES-CARTE-MERE_P07_FPGA_2 (U7.AF12), S7CAS-PLEIADES-CARTE-MERE_P07_ADC (U16.56)
ADC_CLKOUT_P: S7CAS-PLEIADES-CARTE-MERE_P07_FPGA_2 (U7.AD12), S7CAS-PLEIADES-CARTE-MERE_P07_ADC (U16.57)
ADC_CTRL1: S7CAS-PLEIADES-CARTE-MERE_P07_FPGA_2 (U7.AB15), S7CAS-PLEIADES-CARTE-MERE_P07_ADC (U16.35)
ADC_CTRL2: S7CAS-PLEIADES-CARTE-MERE_P07_FPGA_2 (U7.AC14), S7CAS-PLEIADES-CARTE-MERE_P07_ADC (U16.36)
ADC_CTRL3: S7CAS-PLEIADES-CARTE-MERE_P07_FPGA_2 (U7.Y15), S7CAS-PLEIADES-CARTE-MERE_P07_ADC (U16.37)
ADC_RESET: S7CAS-PLEIADES-CARTE-MERE_P07_FPGA_2 (U7.AC16), S7CAS-PLEIADES-CARTE-MERE_P07_ADC (U16.12)
ADC_SCLK: S7CAS-PLEIADES-CARTE-MERE_P07_FPGA_2 (U7.AD17), S7CAS-PLEIADES-CARTE-MERE_P07_ADC (U16.13)
ADC_SDATA: S7CAS-PLEIADES-CARTE-MERE_P07_FPGA_2 (U7.W16), S7CAS-PLEIADES-CARTE-MERE_P07_ADC (U16.14)
ADC_SDOUT: S7CAS-PLEIADES-CARTE-MERE_P07_FPGA_2 (U7.AD15), S7CAS-PLEIADES-CARTE-MERE_P07_ADC (R132.1)
ADC_SEN: S7CAS-PLEIADES-CARTE-MERE_P07_FPGA_2 (U7.V15), S7CAS-PLEIADES-CARTE-MERE_P07_ADC (U16.15)
CLK_100MHz_N: S7CAS-PLEIADES-CARTE-MERE_P07_FPGA_2 (U7.AF13), S7CAS-PLEIADES-CARTE-MERE_P07_CLOCK (U11.17)
CLK_100MHz_P: S7CAS-PLEIADES-CARTE-MERE_P07_FPGA_2 (U7.AE13), S7CAS-PLEIADES-CARTE-MERE_P07_CLOCK (U11.16)
CLK_200MHz_N: S7CAS-PLEIADES-CARTE-MERE_P07_CLOCK (U11.20), S7CAS-PLEIADES-CARTE-MERE_P07_ADC (C211.2 R131.1)
CLK_200MHz_P: S7CAS-PLEIADES-CARTE-MERE_P07_CLOCK (U11.19), S7CAS-PLEIADES-CARTE-MERE_P07_ADC (C210.2 R131.2)
CLK_400MHz_N: S7CAS-PLEIADES-CARTE-MERE_P07_CLOCK (U11.28), S7CAS-PLEIADES-CARTE-MERE_P07_DAC (C243.2 R154.1)
CLK_400MHz_P: S7CAS-PLEIADES-CARTE-MERE_P07_CLOCK (U11.27), S7CAS-PLEIADES-CARTE-MERE_P07_DAC (C242.2 R154.2)
CLK_PLL_LOCK: S7CAS-PLEIADES-CARTE-MERE_P07_FPGA_2 (U7.AD13), S7CAS-PLEIADES-CARTE-MERE_P07_CLOCK (R37.2)
CLK_PWRDN#: S7CAS-PLEIADES-CARTE-MERE_P07_FPGA_2 (U7.AD8), S7CAS-PLEIADES-CARTE-MERE_P07_CLOCK (U11.12)
CLK_SPI_CLK: S7CAS-PLEIADES-CARTE-MERE_P07_FPGA_2 (U7.AC9), S7CAS-PLEIADES-CARTE-MERE_P07_CLOCK (U11.24)
CLK_SPI_CS#: S7CAS-PLEIADES-CARTE-MERE_P07_FPGA_2 (U7.AF8), S7CAS-PLEIADES-CARTE-MERE_P07_CLOCK (U11.25)
CLK_SPI_MISO: S7CAS-PLEIADES-CARTE-MERE_P07_FPGA_2 (U7.AA9), S7CAS-PLEIADES-CARTE-MERE_P07_CLOCK (R39.2)
CLK_SPI_MOSI: S7CAS-PLEIADES-CARTE-MERE_P07_FPGA_2 (U7.AD9), S7CAS-PLEIADES-CARTE-MERE_P07_CLOCK (U11.23)
CLK_SYNC#: S7CAS-PLEIADES-CARTE-MERE_P07_FPGA_2 (U7.AB9), S7CAS-PLEIADES-CARTE-MERE_P07_CLOCK (U11.14)
DA0_N: S7CAS-PLEIADES-CARTE-MERE_P07_FPGA_2 (U7.Y13), S7CAS-PLEIADES-CARTE-MERE_P07_ADC (U16.60)
DA0_P: S7CAS-PLEIADES-CARTE-MERE_P07_FPGA_2 (U7.W13), S7CAS-PLEIADES-CARTE-MERE_P07_ADC (U16.61)
DA2_N: S7CAS-PLEIADES-CARTE-MERE_P07_FPGA_2 (U7.AB13), S7CAS-PLEIADES-CARTE-MERE_P07_ADC (U16.62)
DA2_P: S7CAS-PLEIADES-CARTE-MERE_P07_FPGA_2 (U7.AA13), S7CAS-PLEIADES-CARTE-MERE_P07_ADC (U16.63)
DA4_N: S7CAS-PLEIADES-CARTE-MERE_P07_FPGA_2 (U7.AC12), S7CAS-PLEIADES-CARTE-MERE_P07_ADC (U16.2)
DA4_P: S7CAS-PLEIADES-CARTE-MERE_P07_FPGA_2 (U7.AA12), S7CAS-PLEIADES-CARTE-MERE_P07_ADC (U16.3)
DA6_N: S7CAS-PLEIADES-CARTE-MERE_P07_FPGA_2 (U7.V14), S7CAS-PLEIADES-CARTE-MERE_P07_ADC (U16.4)
DA6_P: S7CAS-PLEIADES-CARTE-MERE_P07_FPGA_2 (U7.U15), S7CAS-PLEIADES-CARTE-MERE_P07_ADC (U16.5)
DA8_N: S7CAS-PLEIADES-CARTE-MERE_P07_FPGA_2 (U7.AB11), S7CAS-PLEIADES-CARTE-MERE_P07_ADC (U16.6)
DA8_P: S7CAS-PLEIADES-CARTE-MERE_P07_FPGA_2 (U7.AA11), S7CAS-PLEIADES-CARTE-MERE_P07_ADC (U16.7)
DA10_N: S7CAS-PLEIADES-CARTE-MERE_P07_FPGA_2 (U7.W14), S7CAS-PLEIADES-CARTE-MERE_P07_ADC (U16.8)
DA10_P: S7CAS-PLEIADES-CARTE-MERE_P07_FPGA_2 (U7.V13), S7CAS-PLEIADES-CARTE-MERE_P07_ADC (U16.9)
DA12_N: S7CAS-PLEIADES-CARTE-MERE_P07_FPGA_2 (U7.AD11), S7CAS-PLEIADES-CARTE-MERE_P07_ADC (U16.10)
DA12_P: S7CAS-PLEIADES-CARTE-MERE_P07_FPGA_2 (U7.AC11), S7CAS-PLEIADES-CARTE-MERE_P07_ADC (U16.11)
DAC_CS#: S7CAS-PLEIADES-CARTE-MERE_P07_FPGA_4-5 (U7.E3), S7CAS-PLEIADES-CARTE-MERE_P07_DAC (U18.33)
DAC_D0_N: S7CAS-PLEIADES-CARTE-MERE_P07_FPGA_2 (U7.AF19), S7CAS-PLEIADES-CARTE-MERE_P07_DAC (U18.28)
DAC_D0_P: S7CAS-PLEIADES-CARTE-MERE_P07_FPGA_2 (U7.AE19), S7CAS-PLEIADES-CARTE-MERE_P07_DAC (U18.27)
DAC_D1_N: S7CAS-PLEIADES-CARTE-MERE_P07_FPGA_2 (U7.AD21), S7CAS-PLEIADES-CARTE-MERE_P07_DAC (U18.26)
DAC_D1_P: S7CAS-PLEIADES-CARTE-MERE_P07_FPGA_2 (U7.AC20), S7CAS-PLEIADES-CARTE-MERE_P07_DAC (U18.25)
DAC_D2_N: S7CAS-PLEIADES-CARTE-MERE_P07_FPGA_2 (U7.AA19), S7CAS-PLEIADES-CARTE-MERE_P07_DAC (U18.24)
DAC_D2_P: S7CAS-PLEIADES-CARTE-MERE_P07_FPGA_2 (U7.Y18), S7CAS-PLEIADES-CARTE-MERE_P07_DAC (U18.23)
DAC_D3_N: S7CAS-PLEIADES-CARTE-MERE_P07_FPGA_2 (U7.AD19), S7CAS-PLEIADES-CARTE-MERE_P07_DAC (U18.22)
DAC_D3_P: S7CAS-PLEIADES-CARTE-MERE_P07_FPGA_2 (U7.AC19), S7CAS-PLEIADES-CARTE-MERE_P07_DAC (U18.21)
DAC_D4_N: S7CAS-PLEIADES-CARTE-MERE_P07_FPGA_2 (U7.W17), S7CAS-PLEIADES-CARTE-MERE_P07_DAC (U18.16)
DAC_D4_P: S7CAS-PLEIADES-CARTE-MERE_P07_FPGA_2 (U7.V16), S7CAS-PLEIADES-CARTE-MERE_P07_DAC (U18.15)
DAC_D5_N: S7CAS-PLEIADES-CARTE-MERE_P07_FPGA_2 (U7.AF18), S7CAS-PLEIADES-CARTE-MERE_P07_DAC (U18.14)
DAC_D5_P: S7CAS-PLEIADES-CARTE-MERE_P07_FPGA_2 (U7.AD18), S7CAS-PLEIADES-CARTE-MERE_P07_DAC (U18.13)
DAC_D6_N: S7CAS-PLEIADES-CARTE-MERE_P07_FPGA_2 (U7.AA17), S7CAS-PLEIADES-CARTE-MERE_P07_DAC (U18.12)
DAC_D6_P: S7CAS-PLEIADES-CARTE-MERE_P07_FPGA_2 (U7.Y16), S7CAS-PLEIADES-CARTE-MERE_P07_DAC (U18.11)
DAC_D7_N: S7CAS-PLEIADES-CARTE-MERE_P07_FPGA_2 (U7.AB18), S7CAS-PLEIADES-CARTE-MERE_P07_DAC (U18.10)
DAC_D7_P: S7CAS-PLEIADES-CARTE-MERE_P07_FPGA_2 (U7.AA18), S7CAS-PLEIADES-CARTE-MERE_P07_DAC (U18.9)
DAC_DCI_N: S7CAS-PLEIADES-CARTE-MERE_P07_FPGA_2 (U7.AF17), S7CAS-PLEIADES-CARTE-MERE_P07_DAC (U18.18)
DAC_DCI_P: S7CAS-PLEIADES-CARTE-MERE_P07_FPGA_2 (U7.AE17), S7CAS-PLEIADES-CARTE-MERE_P07_DAC (U18.17)
DAC_FRAME_N: S7CAS-PLEIADES-CARTE-MERE_P07_FPGA_2 (U7.AF16), S7CAS-PLEIADES-CARTE-MERE_P07_DAC (U18.20)
DAC_FRAME_P: S7CAS-PLEIADES-CARTE-MERE_P07_FPGA_2 (U7.AD16), S7CAS-PLEIADES-CARTE-MERE_P07_DAC (U18.19)
DAC_IRQ#: S7CAS-PLEIADES-CARTE-MERE_P07_FPGA_4-5 (U7.G6), S7CAS-PLEIADES-CARTE-MERE_P07_DAC (R151.1 U18.34)
DAC_RESET#: S7CAS-PLEIADES-CARTE-MERE_P07_FPGA_4-5 (U7.J10), S7CAS-PLEIADES-CARTE-MERE_P07_DAC (U18.36)
DAC_SCLK: S7CAS-PLEIADES-CARTE-MERE_P07_FPGA_4-5 (U7.K9), S7CAS-PLEIADES-CARTE-MERE_P07_DAC (U18.32)
DAC_SDIO: S7CAS-PLEIADES-CARTE-MERE_P07_FPGA_4-5 (U7.E4), S7CAS-PLEIADES-CARTE-MERE_P07_DAC (U18.31)
DAC_TXENABLE: S7CAS-PLEIADES-CARTE-MERE_P07_FPGA_4-5 (U7.G5), S7CAS-PLEIADES-CARTE-MERE_P07_DAC (U18.30)
DB0_N: S7CAS-PLEIADES-CARTE-MERE_P07_FPGA_2 (U7.W12), S7CAS-PLEIADES-CARTE-MERE_P07_ADC (U16.40)
DB0_P: S7CAS-PLEIADES-CARTE-MERE_P07_FPGA_2 (U7.V12), S7CAS-PLEIADES-CARTE-MERE_P07_ADC (U16.41)
DB2_N: S7CAS-PLEIADES-CARTE-MERE_P07_FPGA_2 (U7.AF11), S7CAS-PLEIADES-CARTE-MERE_P07_ADC (U16.42)
DB2_P: S7CAS-PLEIADES-CARTE-MERE_P07_FPGA_2 (U7.AE11), S7CAS-PLEIADES-CARTE-MERE_P07_ADC (U16.43)
DB4_N: S7CAS-PLEIADES-CARTE-MERE_P07_FPGA_2 (U7.AF9), S7CAS-PLEIADES-CARTE-MERE_P07_ADC (U16.44)
DB4_P: S7CAS-PLEIADES-CARTE-MERE_P07_FPGA_2 (U7.AE9), S7CAS-PLEIADES-CARTE-MERE_P07_ADC (U16.45)
DB6_N: S7CAS-PLEIADES-CARTE-MERE_P07_FPGA_2 (U7.AF10), S7CAS-PLEIADES-CARTE-MERE_P07_ADC (U16.46)
DB6_P: S7CAS-PLEIADES-CARTE-MERE_P07_FPGA_2 (U7.AD10), S7CAS-PLEIADES-CARTE-MERE_P07_ADC (U16.47)
DB8_N: S7CAS-PLEIADES-CARTE-MERE_P07_FPGA_2 (U7.U12), S7CAS-PLEIADES-CARTE-MERE_P07_ADC (U16.50)
DB8_P: S7CAS-PLEIADES-CARTE-MERE_P07_FPGA_2 (U7.U13), S7CAS-PLEIADES-CARTE-MERE_P07_ADC (U16.51)
DB10_N: S7CAS-PLEIADES-CARTE-MERE_P07_FPGA_2 (U7.AB10), S7CAS-PLEIADES-CARTE-MERE_P07_ADC (U16.52)
DB10_P: S7CAS-PLEIADES-CARTE-MERE_P07_FPGA_2 (U7.Y10), S7CAS-PLEIADES-CARTE-MERE_P07_ADC (U16.53)
DB12_N: S7CAS-PLEIADES-CARTE-MERE_P07_FPGA_2 (U7.W11), S7CAS-PLEIADES-CARTE-MERE_P07_ADC (U16.54)
DB12_P: S7CAS-PLEIADES-CARTE-MERE_P07_FPGA_2 (U7.V11), S7CAS-PLEIADES-CARTE-MERE_P07_ADC (U16.55)
DRAM_A0: S7CAS-PLEIADES-CARTE-MERE_P07_FPGA_3 (U7.N7), S7CAS-PLEIADES-CARTE-MERE_P07_DDR (R41.1 U12.N3)
DRAM_A1: S7CAS-PLEIADES-CARTE-MERE_P07_FPGA_3 (U7.N6), S7CAS-PLEIADES-CARTE-MERE_P07_DDR (R42.1 U12.P7)
DRAM_A2: S7CAS-PLEIADES-CARTE-MERE_P07_FPGA_3 (U7.R9), S7CAS-PLEIADES-CARTE-MERE_P07_DDR (R70.1 U12.P3)
DRAM_A3: S7CAS-PLEIADES-CARTE-MERE_P07_FPGA_3 (U7.P7), S7CAS-PLEIADES-CARTE-MERE_P07_DDR (R43.1 U12.N2)
DRAM_A4: S7CAS-PLEIADES-CARTE-MERE_P07_FPGA_3 (U7.N9), S7CAS-PLEIADES-CARTE-MERE_P07_DDR (R44.1 U12.P8)
DRAM_A5: S7CAS-PLEIADES-CARTE-MERE_P07_FPGA_3 (U7.R2), S7CAS-PLEIADES-CARTE-MERE_P07_DDR (R45.1 U12.P2)
DRAM_A6: S7CAS-PLEIADES-CARTE-MERE_P07_FPGA_3 (U7.R1), S7CAS-PLEIADES-CARTE-MERE_P07_DDR (R46.1 U12.R8)
DRAM_A7: S7CAS-PLEIADES-CARTE-MERE_P07_FPGA_3 (U7.P10), S7CAS-PLEIADES-CARTE-MERE_P07_DDR (R47.1 U12.R2)
DRAM_A8: S7CAS-PLEIADES-CARTE-MERE_P07_FPGA_3 (U7.N4), S7CAS-PLEIADES-CARTE-MERE_P07_DDR (R48.1 U12.T8)
DRAM_A9: S7CAS-PLEIADES-CARTE-MERE_P07_FPGA_3 (U7.N3), S7CAS-PLEIADES-CARTE-MERE_P07_DDR (R49.1 U12.R3)
DRAM_A10: S7CAS-PLEIADES-CARTE-MERE_P07_FPGA_3 (U7.M10), S7CAS-PLEIADES-CARTE-MERE_P07_DDR (R50.1 U12.L7)
DRAM_A11: S7CAS-PLEIADES-CARTE-MERE_P07_FPGA_3 (U7.L3), S7CAS-PLEIADES-CARTE-MERE_P07_DDR (R51.1 U12.R7)
DRAM_A12: S7CAS-PLEIADES-CARTE-MERE_P07_FPGA_3 (U7.M8), S7CAS-PLEIADES-CARTE-MERE_P07_DDR (R52.1 U12.N7)
DRAM_A13: S7CAS-PLEIADES-CARTE-MERE_P07_FPGA_3 (U7.M6), S7CAS-PLEIADES-CARTE-MERE_P07_DDR (R53.1 U12.T3)
DRAM_BA0: S7CAS-PLEIADES-CARTE-MERE_P07_FPGA_3 (U7.P3), S7CAS-PLEIADES-CARTE-MERE_P07_DDR (R54.1 U12.M2)
DRAM_BA1: S7CAS-PLEIADES-CARTE-MERE_P07_FPGA_3 (U7.P1), S7CAS-PLEIADES-CARTE-MERE_P07_DDR (R55.1 U12.N8)
DRAM_BA2: S7CAS-PLEIADES-CARTE-MERE_P07_FPGA_3 (U7.N5), S7CAS-PLEIADES-CARTE-MERE_P07_DDR (R56.1 U12.M3)
DRAM_CAS#: S7CAS-PLEIADES-CARTE-MERE_P07_FPGA_3 (U7.P8), S7CAS-PLEIADES-CARTE-MERE_P07_DDR (R66.2 U12.K3)
DRAM_CK_N: S7CAS-PLEIADES-CARTE-MERE_P07_FPGA_3 (U7.R3), S7CAS-PLEIADES-CARTE-MERE_P07_DDR (R69.2 U12.K7)
DRAM_CK_P: S7CAS-PLEIADES-CARTE-MERE_P07_FPGA_3 (U7.R4), S7CAS-PLEIADES-CARTE-MERE_P07_DDR (R68.2 U12.J7)
DRAM_CKE: S7CAS-PLEIADES-CARTE-MERE_P07_FPGA_3 (U7.M9), S7CAS-PLEIADES-CARTE-MERE_P07_DDR (R62.2 U12.K9)
DRAM_DQ0: S7CAS-PLEIADES-CARTE-MERE_P07_FPGA_3 (U7.Y3), S7CAS-PLEIADES-CARTE-MERE_P07_DDR (U12.E3)
DRAM_DQ1: S7CAS-PLEIADES-CARTE-MERE_P07_FPGA_3 (U7.Y1), S7CAS-PLEIADES-CARTE-MERE_P07_DDR (U12.F7)
DRAM_DQ2: S7CAS-PLEIADES-CARTE-MERE_P07_FPGA_3 (U7.W2), S7CAS-PLEIADES-CARTE-MERE_P07_DDR (U12.F2)
DRAM_DQ3: S7CAS-PLEIADES-CARTE-MERE_P07_FPGA_3 (U7.W1), S7CAS-PLEIADES-CARTE-MERE_P07_DDR (U12.F8)
DRAM_DQ4: S7CAS-PLEIADES-CARTE-MERE_P07_FPGA_3 (U7.T3), S7CAS-PLEIADES-CARTE-MERE_P07_DDR (U12.H3)
DRAM_DQ5: S7CAS-PLEIADES-CARTE-MERE_P07_FPGA_3 (U7.T1), S7CAS-PLEIADES-CARTE-MERE_P07_DDR (U12.H8)
DRAM_DQ6: S7CAS-PLEIADES-CARTE-MERE_P07_FPGA_3 (U7.U2), S7CAS-PLEIADES-CARTE-MERE_P07_DDR (U12.G2)
DRAM_DQ7: S7CAS-PLEIADES-CARTE-MERE_P07_FPGA_3 (U7.U1), S7CAS-PLEIADES-CARTE-MERE_P07_DDR (U12.H7)
DRAM_DQ8: S7CAS-PLEIADES-CARTE-MERE_P07_FPGA_3 (U7.AA2), S7CAS-PLEIADES-CARTE-MERE_P07_DDR (U12.D7)
DRAM_DQ9: S7CAS-PLEIADES-CARTE-MERE_P07_FPGA_3 (U7.AA1), S7CAS-PLEIADES-CARTE-MERE_P07_DDR (U12.C3)
DRAM_DQ10: S7CAS-PLEIADES-CARTE-MERE_P07_FPGA_3 (U7.AE2), S7CAS-PLEIADES-CARTE-MERE_P07_DDR (U12.C8)
DRAM_DQ11: S7CAS-PLEIADES-CARTE-MERE_P07_FPGA_3 (U7.AE1), S7CAS-PLEIADES-CARTE-MERE_P07_DDR (U12.C2)
DRAM_DQ12: S7CAS-PLEIADES-CARTE-MERE_P07_FPGA_3 (U7.AD3), S7CAS-PLEIADES-CARTE-MERE_P07_DDR (U12.A7)
DRAM_DQ13: S7CAS-PLEIADES-CARTE-MERE_P07_FPGA_3 (U7.AD1), S7CAS-PLEIADES-CARTE-MERE_P07_DDR (U12.A2)
DRAM_DQ14: S7CAS-PLEIADES-CARTE-MERE_P07_FPGA_3 (U7.AB3), S7CAS-PLEIADES-CARTE-MERE_P07_DDR (U12.B8)
DRAM_DQ15: S7CAS-PLEIADES-CARTE-MERE_P07_FPGA_3 (U7.AB1), S7CAS-PLEIADES-CARTE-MERE_P07_DDR (U12.A3)
DRAM_LDM: S7CAS-PLEIADES-CARTE-MERE_P07_FPGA_3 (U7.W3), S7CAS-PLEIADES-CARTE-MERE_P07_DDR (R64.2 U12.E7)
DRAM_LDQS_N: S7CAS-PLEIADES-CARTE-MERE_P07_FPGA_3 (U7.V1), S7CAS-PLEIADES-CARTE-MERE_P07_DDR (U12.G3)
DRAM_LDQS_P: S7CAS-PLEIADES-CARTE-MERE_P07_FPGA_3 (U7.V3), S7CAS-PLEIADES-CARTE-MERE_P07_DDR (U12.F3)
DRAM_ODT: S7CAS-PLEIADES-CARTE-MERE_P07_FPGA_3 (U7.P6), S7CAS-PLEIADES-CARTE-MERE_P07_DDR (R57.1 U12.K1)
DRAM_RAS#: S7CAS-PLEIADES-CARTE-MERE_P07_FPGA_3 (U7.N8), S7CAS-PLEIADES-CARTE-MERE_P07_DDR (R65.2 U12.J3)
DRAM_RESET#: S7CAS-PLEIADES-CARTE-MERE_P07_FPGA_3 (U7.L4), S7CAS-PLEIADES-CARTE-MERE_P07_DDR (U12.T2)
DRAM_UDM: S7CAS-PLEIADES-CARTE-MERE_P07_FPGA_3 (U7.V4), S7CAS-PLEIADES-CARTE-MERE_P07_DDR (R63.2 U12.D3)
DRAM_UDQS_N: S7CAS-PLEIADES-CARTE-MERE_P07_FPGA_3 (U7.AC1), S7CAS-PLEIADES-CARTE-MERE_P07_DDR (U12.B7)
DRAM_UDQS_P: S7CAS-PLEIADES-CARTE-MERE_P07_FPGA_3 (U7.AC2), S7CAS-PLEIADES-CARTE-MERE_P07_DDR (U12.C7)
DRAM_WE#: S7CAS-PLEIADES-CARTE-MERE_P07_FPGA_3 (U7.P5), S7CAS-PLEIADES-CARTE-MERE_P07_DDR (R67.2 U12.L3)
ETH_COL: S7CAS-PLEIADES-CARTE-MERE_P07_FPGA_0 (U7.A19), S7CAS-PLEIADES-CARTE-MERE_P07_ETH (R97.2)
ETH_CRS: S7CAS-PLEIADES-CARTE-MERE_P07_FPGA_0 (U7.C19), S7CAS-PLEIADES-CARTE-MERE_P07_ETH (R99.2)
ETH_INTER: S7CAS-PLEIADES-CARTE-MERE_P07_FPGA_0 (U7.B14), S7CAS-PLEIADES-CARTE-MERE_P07_ETH (R95.1 R100.2)
ETH_MDC: S7CAS-PLEIADES-CARTE-MERE_P07_FPGA_0 (U7.A9), S7CAS-PLEIADES-CARTE-MERE_P07_ETH (U15.12)
ETH_MDIO: S7CAS-PLEIADES-CARTE-MERE_P07_FPGA_0 (U7.A8), S7CAS-PLEIADES-CARTE-MERE_P07_ETH (R96.1 U15.11)
ETH_RST#: S7CAS-PLEIADES-CARTE-MERE_P07_FPGA_0 (U7.B20), S7CAS-PLEIADES-CARTE-MERE_P07_ETH (D7.1)
ETH_RXC: S7CAS-PLEIADES-CARTE-MERE_P07_FPGA_0 (U7.A13), S7CAS-PLEIADES-CARTE-MERE_P07_ETH (R112.2)
ETH_RXD0: S7CAS-PLEIADES-CARTE-MERE_P07_FPGA_0 (U7.C11), S7CAS-PLEIADES-CARTE-MERE_P07_ETH (R103.2)
ETH_RXD1: S7CAS-PLEIADES-CARTE-MERE_P07_FPGA_0 (U7.A11), S7CAS-PLEIADES-CARTE-MERE_P07_ETH (R109.2)
ETH_RXD2: S7CAS-PLEIADES-CARTE-MERE_P07_FPGA_0 (U7.B10), S7CAS-PLEIADES-CARTE-MERE_P07_ETH (R110.2)
ETH_RXD3: S7CAS-PLEIADES-CARTE-MERE_P07_FPGA_0 (U7.A10), S7CAS-PLEIADES-CARTE-MERE_P07_ETH (R111.2)
ETH_RXDV: S7CAS-PLEIADES-CARTE-MERE_P07_FPGA_0 (U7.A12), S7CAS-PLEIADES-CARTE-MERE_P07_ETH (R101.2)
ETH_RXER: S7CAS-PLEIADES-CARTE-MERE_P07_FPGA_0 (U7.A14), S7CAS-PLEIADES-CARTE-MERE_P07_ETH (R102.2)
ETH_TXC: S7CAS-PLEIADES-CARTE-MERE_P07_FPGA_0 (U7.A15), S7CAS-PLEIADES-CARTE-MERE_P07_ETH (R113.2)
ETH_TXD0: S7CAS-PLEIADES-CARTE-MERE_P07_FPGA_0 (U7.A17), S7CAS-PLEIADES-CARTE-MERE_P07_ETH (U15.24)
ETH_TXD1: S7CAS-PLEIADES-CARTE-MERE_P07_FPGA_0 (U7.C17), S7CAS-PLEIADES-CARTE-MERE_P07_ETH (U15.25)
ETH_TXD2: S7CAS-PLEIADES-CARTE-MERE_P07_FPGA_0 (U7.A18), S7CAS-PLEIADES-CARTE-MERE_P07_ETH (U15.26)
ETH_TXD3: S7CAS-PLEIADES-CARTE-MERE_P07_FPGA_0 (U7.B18), S7CAS-PLEIADES-CARTE-MERE_P07_ETH (U15.27)
ETH_TXEN: S7CAS-PLEIADES-CARTE-MERE_P07_FPGA_0 (U7.A16), S7CAS-PLEIADES-CARTE-MERE_P07_ETH (U15.23)
ETH_TXER: S7CAS-PLEIADES-CARTE-MERE_P07_FPGA_0 (U7.A20), S7CAS-PLEIADES-CARTE-MERE_P07_ETH (U15.31)
JTAG_TCK: S7CAS-PLEIADES-CARTE-MERE_P07_FPGA_MISC (U7.E21), S7CAS-PLEIADES-CARTE-MERE_P07_USB (R74.1)
JTAG_TDI: S7CAS-PLEIADES-CARTE-MERE_P07_FPGA_MISC (U7.F20), S7CAS-PLEIADES-CARTE-MERE_P07_USB (M1.12)
JTAG_TDO: S7CAS-PLEIADES-CARTE-MERE_P07_FPGA_MISC (U7.A24), S7CAS-PLEIADES-CARTE-MERE_P07_USB (R75.1)
JTAG_TMS: S7CAS-PLEIADES-CARTE-MERE_P07_FPGA_MISC (U7.C23), S7CAS-PLEIADES-CARTE-MERE_P07_USB (R76.1)
MOT_DIR: S7CAS-PLEIADES-CARTE-MERE_P07_FPGA_0 (U7.A7), S7CAS-PLEIADES-CARTE-MERE_P07_MOT (U14.3)
MOT_ENA#: S7CAS-PLEIADES-CARTE-MERE_P07_FPGA_0 (U7.B6), S7CAS-PLEIADES-CARTE-MERE_P07_MOT (U14.26)
MOT_HOME: S7CAS-PLEIADES-CARTE-MERE_P07_FPGA_0 (U7.C7), S7CAS-PLEIADES-CARTE-MERE_P07_MOT (Q2.3 R87.1)
MOT_RESET#: S7CAS-PLEIADES-CARTE-MERE_P07_FPGA_0 (U7.B4), S7CAS-PLEIADES-CARTE-MERE_P07_MOT (U14.17)
MOT_SLP#: S7CAS-PLEIADES-CARTE-MERE_P07_FPGA_0 (U7.C6), S7CAS-PLEIADES-CARTE-MERE_P07_MOT (U14.27)
MOT_SR#: S7CAS-PLEIADES-CARTE-MERE_P07_FPGA_0 (U7.A4), S7CAS-PLEIADES-CARTE-MERE_P07_MOT (U14.16)
MOT_STEP: S7CAS-PLEIADES-CARTE-MERE_P07_FPGA_0 (U7.A5), S7CAS-PLEIADES-CARTE-MERE_P07_MOT (U14.19)
MOT_USM0: S7CAS-PLEIADES-CARTE-MERE_P07_FPGA_0 (U7.C5), S7CAS-PLEIADES-CARTE-MERE_P07_MOT (U14.13)
MOT_USM1: S7CAS-PLEIADES-CARTE-MERE_P07_FPGA_0 (U7.A6), S7CAS-PLEIADES-CARTE-MERE_P07_MOT (U14.12)
PROGRAM_B: S7CAS-PLEIADES-CARTE-MERE_P07_FPGA_2 (Q1.3 R20.1 U7.AF3), S7CAS-PLEIADES-CARTE-MERE_P07_USB (M1.9)
UART_CTS: S7CAS-PLEIADES-CARTE-MERE_P07_FPGA_2 (U7.AC17), S7CAS-PLEIADES-CARTE-MERE_P07_USB (M1.3)
UART_RTS: S7CAS-PLEIADES-CARTE-MERE_P07_FPGA_2 (U7.AB17), S7CAS-PLEIADES-CARTE-MERE_P07_USB (R80.1)
UART_RXD: S7CAS-PLEIADES-CARTE-MERE_P07_FPGA_2 (U7.AF15), S7CAS-PLEIADES-CARTE-MERE_P07_USB (M1.5)
UART_TXD: S7CAS-PLEIADES-CARTE-MERE_P07_FPGA_2 (U7.AE15), S7CAS-PLEIADES-CARTE-MERE_P07_USB (R77.1)